# Altium project PCB_Project1.PrjPCB
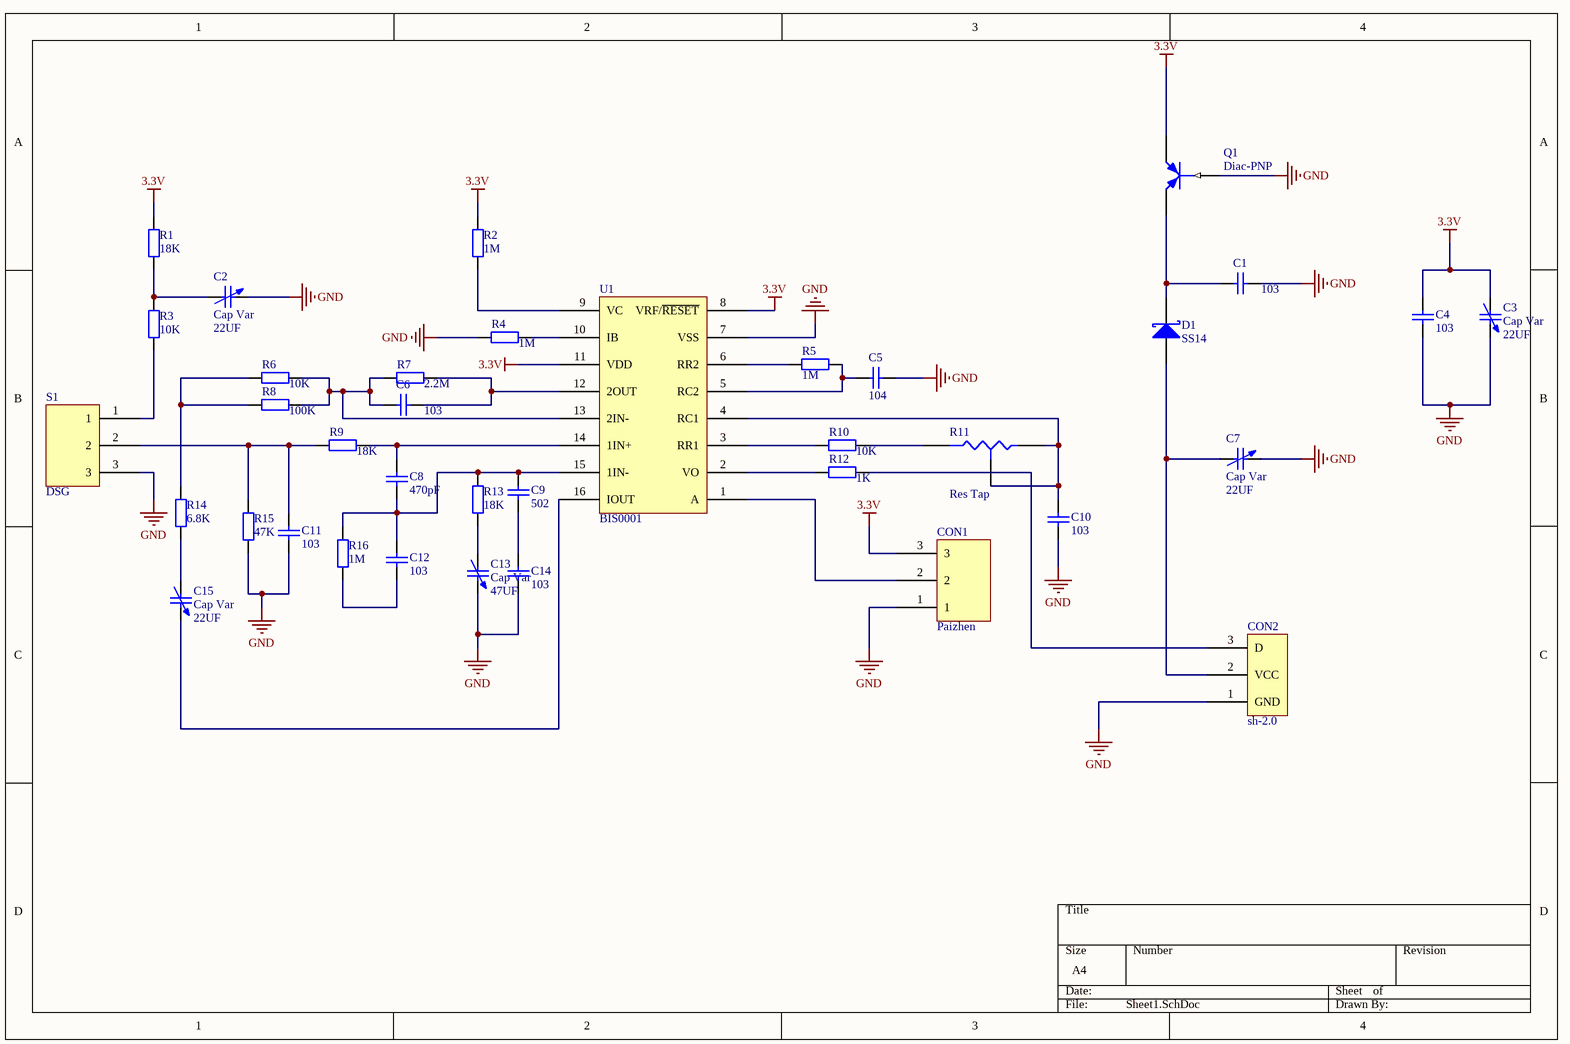
[diagram p0: Sheet1.SchDoc]
1 sheet, 37 parts. Net scope: global (net labels, ports and power ports of the same name join across sheets).
Board file: PCB1.PcbDoc

## Sheet Sheet1.SchDoc
size A4

### Parts
C1  value 103  [1608[0603]]  (hidden comment: Cap)
C2  Cap Var  value 22UF  [C1206]
C3  Cap Var  value 22UF  [C1206]
C4  value 103  [1608[0603]]  (hidden comment: Cap)
C5  value 104  [1608[0603]]  (hidden comment: Cap)
C6  value 103  [1608[0603]]  (hidden comment: Cap)
C7  Cap Var  value 22UF  [C1206]
C8  value 470pF  [1608[0603]]  (hidden comment: Cap)
C9  value 502  [1608[0603]]  (hidden comment: Cap)
C10  value 103  [1608[0603]]  (hidden comment: Cap)
C11  value 103  [1608[0603]]  (hidden comment: Cap)
C12  value 103  [1608[0603]]  (hidden comment: Cap)
C13  Cap Var  value 47UF  [C1206]
C14  value 103  [1608[0603]]  (hidden comment: Cap)
C15  Cap Var  value 22UF  [C1206]
CON1  Paizhen  [Paizhen]
CON2  sh-2.0  [sh-2.0]
D1  SS14  [SMB]
Q1  Diac-PNP  [SOT89L]
R1  value 18K  [1608[0603]]  (hidden comment: Res2)
R2  value 1M  [1608[0603]]  (hidden comment: Res2)
R3  value 10K  [1608[0603]]  (hidden comment: Res2)
R4  value 1M  [1608[0603]]  (hidden comment: Res2)
R5  value 1M  [1608[0603]]  (hidden comment: Res2)
R6  value 10K  [1608[0603]]  (hidden comment: Res2)
R7  value 2.2M  [1608[0603]]  (hidden comment: Res2)
R8  value 100K  [1608[0603]]  (hidden comment: Res2)
R9  value 18K  [1608[0603]]  (hidden comment: Res2)
R10  value 10K  [1608[0603]]  (hidden comment: Res2)
R11  Res Tap  [R_change]
R12  value 1K  [1608[0603]]  (hidden comment: Res2)
R13  value 18K  [1608[0603]]  (hidden comment: Res2)
R14  value 6.8K  [1608[0603]]  (hidden comment: Res2)
R15  value 47K  [1608[0603]]  (hidden comment: Res2)
R16  value 1M  [1608[0603]]  (hidden comment: Res2)
S1  DSG  [DSG]
U1  BIS0001  [SO-16_N]

### Nets
3.3V: C3.1 C4.2 CON1.3 Q1.3(C) R1.1 R2.1 U1.8(VRF/~{RESET}) U1.11(VDD)
GND: C1.2 C2.2 C3.2 C4.1 C5.1 C7.2 C10.1 C11.1 C13.2 C14.1 CON1.1 CON2.1(GND) Q1.1(B) R4.2 R15.2 S1.3 U1.7(VSS)
NetC1_1: C1.1 D1.2(K) Q1.2(E)
NetC2_1: C2.1 R1.2 R3.1
NetC5_2: C5.2 R5.1 U1.5(RC2)
NetC6_1: C6.1 R6.1 R7.2 R8.1 U1.13(2IN-)
NetC6_2: C6.2 R7.1 U1.12(2OUT)
NetC7_1: C7.1 CON2.2(VCC) D1.1(A)
NetC8_1: C8.1 C9.2 C12.2 R13.1 R16.1 U1.15(1IN-)
NetC8_2: C8.2 R9.1 U1.14(1IN+)
NetC9_1: C9.1 C14.2
NetC10_2: C10.2 R11.1(A) R11.3(TAP) U1.4(RC1)
NetC11_2: C11.2 R9.2 R15.1 S1.2
NetC12_1: C12.1 R16.2
NetC13_1: C13.1 R13.2
NetC15_1: C15.1 R14.2
NetC15_2: C15.2 U1.16(IOUT)
NetCON1_2: CON1.2 U1.1(A)
NetCON2_3: CON2.3(D) R12.1
NetR2_2: R2.2 U1.9(VC)
NetR3_2: R3.2 S1.1
NetR4_1: R4.1 U1.10(IB)
NetR5_2: R5.2 U1.6(RR2)
NetR6_2: R6.2 R8.2 R14.1
NetR10_1: R10.1 R11.2(B)
NetR10_2: R10.2 U1.3(RR1)
NetR12_2: R12.2 U1.2(VO)

### Library data of the parts
C1 C4-C6 C8-C12 C14 = Cap: Capacitor; Published: 8-Jun-2000; LatestRevisionDate: 17-Jul-2002; LatestRevisionNote: Re-released for DXP Platform.; PackageReference: RAD-0.3; Publisher: Altium Limited; PackageDescription: Radial Cap, Thru-Hole; 2 Leads; 0.3 in Pin Spacing
C2 C3 C7 C13 C15 = Cap Var: Variable or Adjustable Capacitor; Published: 24-Mar-1999; LatestRevisionDate: 29-May-2009; LatestRevisionNote: IPC-7351 Footprint Added.; PackageReference: C1210; Publisher: Altium Limited; PackageDescription: Chip Capacitor 1210 Case Size; Code_JEITA: 1210; Code_IPC: CAPC3225
CON2 = sh-2.0: pin to pad: 1>3 3>1
D1 = D Schottky: Schottky Diode; Published: 8-Jun-2000; LatestRevisionDate: 17-Jul-2002; LatestRevisionNote: Re-released for DXP Platform.; PackageReference: SMB; Publisher: Altium Limited; PackageDescription: DO-214-AA/SMB; 2 C-Bend Leads; Body 5.3 x 3.6 mm, inc. leads (LxW); Code_JEDEC: DO-214-AA
Q1 = Diac-PNP: DIAC; Published: 24-Mar-1999; LatestRevisionDate: 29-May-2009; LatestRevisionNote: IPC-7351 Footprint Added.; PackageVersion: Jul-2004; PackageReference: SOT89; Publisher: Altium Limited; PackageDescription: 3-Pin SOT-89 Package 1.5 mm Pitch, 4.1 mm Lead Span; Code_JEDEC: TO-243-AA
R1-R10 R12-R16 = Res2: Resistor; Published: 8-Jun-2000; LatestRevisionDate: 17-Jul-2002; LatestRevisionNote: Re-released for DXP Platform.; PackageReference: AXIAL-0.4; Publisher: Altium Limited; PackageDescription: Axial Device, Thru-Hole; 2 Leads; 0.4 in Pin Spacing
U1 = BISS0001